# EAGLE board untitled (EAGLE 9.6.2), part 1 of 2
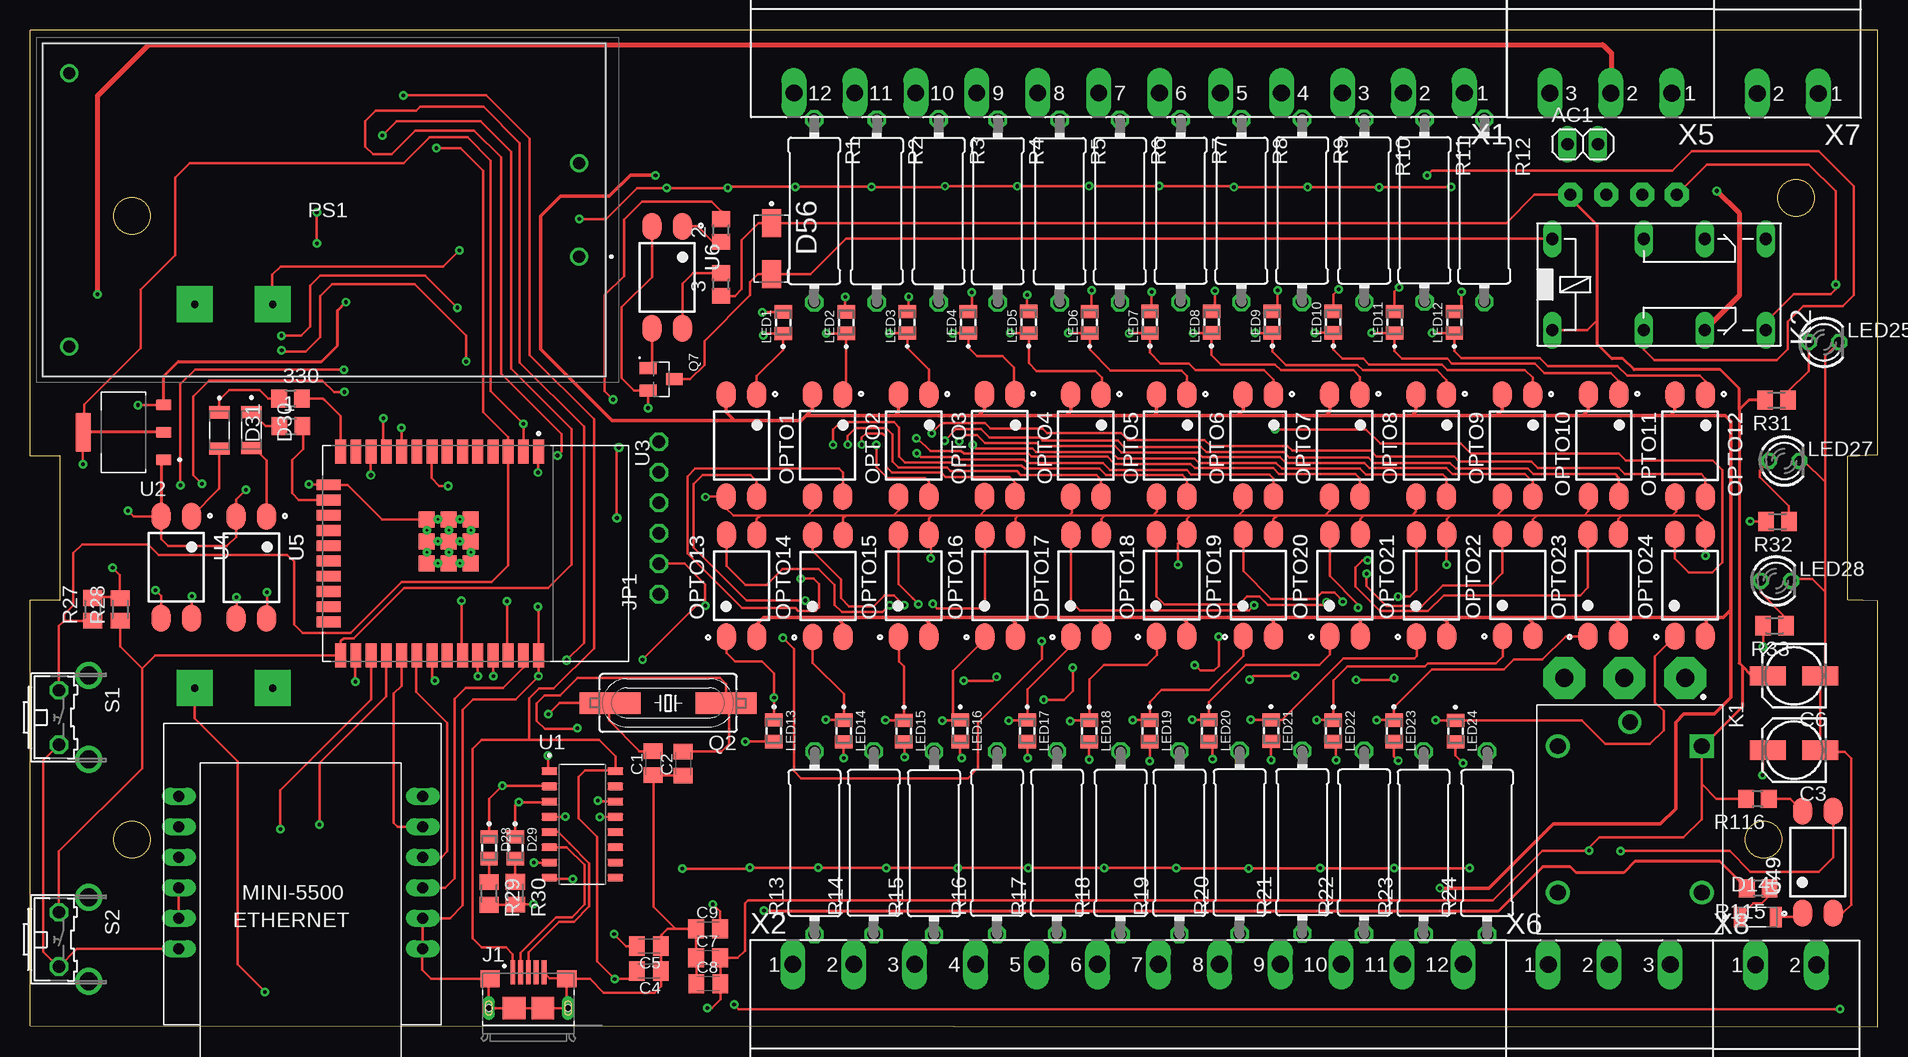
[diagram p2: board, top side]
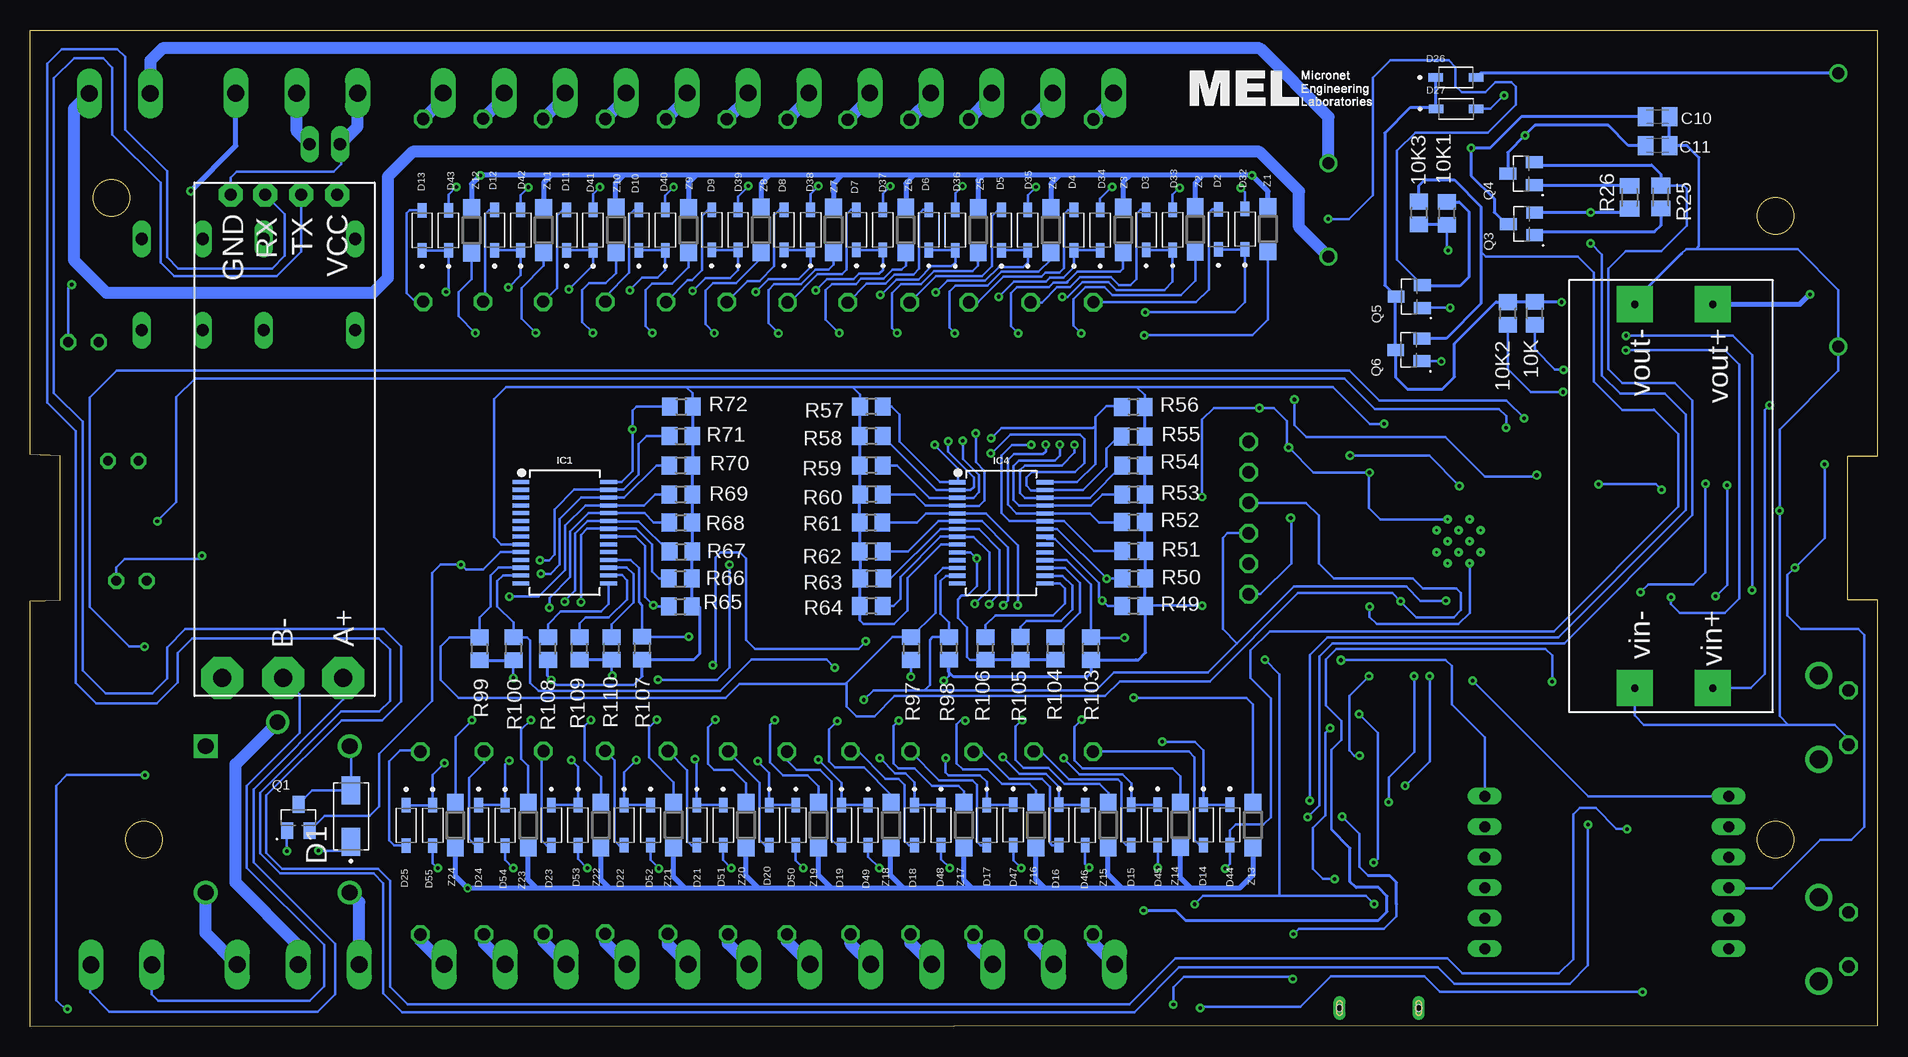
[diagram p3: board, bottom side, seen from below]

Size 154 x 83.1 mm. Coordinates in mm from the lower left corner, seen from the top.
Outline: 0,0.1 154,0 154,35.5 151.5,35.6 151.5,47.6 154,47.7 154,83.1 0,83.1 0,47.6 2.5,47.6 2.5,35.6 0,35.6 0,0.1
Outline: circle at 8.5,67.6 radius 1.5
Outline: circle at 8.5,15.6 radius 1.5
Outline: circle at 144.5,15.6 radius 1.5
Outline: circle at 147.2,69.1 radius 1.5
Copper layers (1*16): Top 0.035mm / dielectric 1.5mm / Bottom 0.035mm
Design rules "default *": minimum track width 6mil, minimum drill 0.3mm, track to track 6mil, track to pad 6mil, pad to pad 6mil, via to via 6mil, smd to smd 6mil, copper to edge 40mil, drill to drill 6mil, minimum pad ring 10mil, minimum via ring 8mil, stop-mask expansion 4mil, vias tented up to drill 0mil, thermal gap 10mil
Net classes: 0 default: drill 0.3 mm, clearance 0.2 mm

## Footprints (pad centres in the part's own frame; a part is rotated, then mirrored left to right if it is on the bottom)
R0805 = smd 1.3 x 1.5: 1 -0.95,0; 2 0.95,0
1X02 = drill 1.016 long: 1 -1.27,0; 2 1.27,0
C0805K = smd 1.3 x 1.6: 1 -1,0; 2 1,0
153CLV-0505 = smd 3 x 1.6: + 2.2,0; - -2.2,0
DIOM5226X240N = smd 2.33 x 1.55: A 2.135,0; C -2.135,0
SOD3715X145N = smd 1.21 x 0.73: A 1.68,0; C -1.68,0
LEDC2012X120N = smd 1.1 x 1.45: A 0.9,0; C -0.9,0
LEDC3216X120N = smd 1.01 x 1.73: + -1.51,0; - 1.51,0
SSOP28DB = smd 0.348 x 1.397: 1 -4.225,-3.656; 2 -3.575,-3.656; 3 -2.925,-3.656; 4 -2.275,-3.656; 5 -1.625,-3.656; 6 -0.975,-3.656; 7 -0.325,-3.656; 8 0.325,-3.656; 9 0.975,-3.656; 10 1.625,-3.656; 11 2.275,-3.656; 12 2.925,-3.656; 13 3.575,-3.656; 14 4.225,-3.656; 15 4.225,3.656; 16 3.575,3.656; 17 2.925,3.656; 18 2.275,3.656; 19 1.625,3.656; 20 0.975,3.656; 21 0.325,3.656; 22 -0.325,3.656; 23 -0.975,3.656; 24 -1.625,3.656; 25 -2.275,3.656; 26 -2.925,3.656; 27 -3.575,3.656; 28 -4.225,3.656
FCI_10118193-0001LF = smd 0.4 x 2: 1 -1.3,2.975; 2 -0.65,2.975; 3 0,2.975; 4 0.65,2.975; 5 1.3,2.975 | smd 1.6 x 1.4: S1 -3.2,2.45; S2 3.2,2.45 | smd 1.9 x 1.9: S3 1.2,0; S4 -1.2,0 | drill 0.5 pad 0.9 long: S5 -3.3,0; S6 3.3,0 | hole 0.5: -3.3,0; 3.3,0
1X06-CLEAN = drill 1.016 octagon: 1 -6.35,0; 2 -3.81,0; 3 -1.27,0; 4 1.27,0; 5 3.81,0; 6 6.35,0
RELAY_SRD-05VDC-SL-C = drill 1.32 square: A1 -6.1,6 | drill 1.32: A2 -6.1,-6; NC 6.1,6; NO 6.1,-6 | drill 1.29: COM -8.1,0
351 = drill 1.016 long: 1 -3.81,-3.81; 16 -3.81,3.81; O1 8.89,-3.81; O2 8.89,3.81; P1 3.81,-3.81; P2 3.81,3.81; S1 13.97,-3.81; S2 13.97,3.81
LED3MM = drill 0.813 octagon: A -1.27,0; K 1.27,0
MT3608 = drill 0.6 pad 3 square: VIN+ 22,-3; VIN- 22,-9.5; VOUT+ -10,-3; VOUT- -10,-9.5
SOT254P975X400-4N = smd 2.25 x 1.6: 1 -4.25,1.27; 2 -4.25,-1.27; 3 4.25,-1.27; 4 4.25,1.27
HLK10M05 = drill 1 pad 1.5: 1 0,0; 2 0,-7.8; 3 42.5,7.5; 4 42.5,-15.3
SOT95P240X120-3N = smd 1 x 1.4: 1 -0.95,-1.1; 2 0.95,-1.1; 3 0,1.1
SM49 = smd 5.08 x 1.778: 1 -4.826,0; 2 4.826,0
0414/15 = drill 1.016 octagon: 1 -7.62,0; 2 7.62,0
M0805 = smd 1.3 x 1.6: 1 -0.95,0; 2 0.95,0
B3F-31XX = drill 1.016 octagon: 1 -2.261,-1.245; 2 2.261,-1.245 | drill 1.499 pad 2.159: 3 -3.505,1.245; 4 3.505,1.245
TTL-RS485 = drill 1.5 pad 3.5 octagon: A -19.7,-6; B -19.7,-1; P$7 -19.7,4.1 | drill 1 pad 2 octagon: GND 20.6,3.37; RX 20.581,0.505; TX 20.583,-2.493; VCC 20.6,-5.47
SOIC127P600X180-16N = smd 1.31 x 0.62: 1 -2.75,4.445; 2 -2.75,3.175; 3 -2.75,1.905; 4 -2.75,0.635; 5 -2.75,-0.635; 6 -2.75,-1.905; 7 -2.75,-3.175; 8 -2.75,-4.445; 9 2.75,-4.445; 10 2.75,-3.175; 11 2.75,-1.905; 12 2.75,-0.635; 13 2.75,0.635; 14 2.75,1.905; 15 2.75,3.175; 16 2.75,4.445
SOT229P700X180-4N = smd 1.31 x 0.93: 1 -3.345,2.29; 2 -3.345,0; 3 -3.345,-2.29 | smd 1.31 x 3.24: 4 3.345,0
MODULE_ESP32-WROOM-32D = smd 2 x 0.9: 1 -8.5,5.26; 2 -8.5,3.99; 3 -8.5,2.72; 4 -8.5,1.45; 5 -8.5,0.18; 6 -8.5,-1.09; 7 -8.5,-2.36; 8 -8.5,-3.63; 9 -8.5,-4.9; 10 -8.5,-6.17; 11 -8.5,-7.44; 12 -8.5,-8.71; 13 -8.5,-9.98; 14 -8.5,-11.25; 25 8.5,-11.25; 26 8.5,-9.98; 27 8.5,-8.71; 28 8.5,-7.44; 29 8.5,-6.17; 30 8.5,-4.9; 31 8.5,-3.63; 32 8.5,-2.36; 33 8.5,-1.09; 34 8.5,0.18; 35 8.5,1.45; 36 8.5,2.72; 37 8.5,3.99; 38 8.5,5.26 | smd 0.9 x 2: 15 -5.715,-12.25; 16 -4.445,-12.25; 17 -3.175,-12.25; 18 -1.905,-12.25; 19 -0.635,-12.25; 20 0.635,-12.25; 21 1.905,-12.25; 22 3.175,-12.25; 23 4.445,-12.25; 24 5.715,-12.25 | smd 1.33 x 1.33: 39_1 -2.835,-0.405; 39_2 -1,-0.405; 39_3 0.835,-0.405; 39_4 -2.835,-2.24; 39_5 -1,-2.24; 39_6 0.835,-2.24; 39_7 -2.835,-4.075; 39_8 -1,-4.075; 39_9 0.835,-4.075 | drill 0.2 pad 0.3: 39_10 -1.917,-0.405; 39_11 -0.083,-0.405; 39_12 -2.835,-1.323; 39_13 -1,-1.323; 39_14 0.835,-1.323; 39_15 -1.917,-2.24; 39_16 -0.083,-2.24; 39_17 -2.835,-3.158; 39_18 -1,-3.158; 39_19 0.835,-3.158; 39_20 -1.917,-4.075; 39_21 -0.083,-4.075
MINI_W5500 = drill 0.914 long: 3V3 21.844,-8.89; 3V3.2 21.844,-11.43; CS 1.524,-16.51; GND 1.524,-6.35; GND.2 1.524,-8.89; GND.3 21.844,-6.35; INT 1.524,-19.05; MISO 21.844,-19.05; MOSI 1.524,-11.43; NC 21.844,-13.97; RST 21.844,-16.51; SCLK 1.524,-13.97
MSTBA12 = drill 1.397 long: 1 -27.94,5.08; 2 -22.86,5.08; 3 -17.78,5.08; 4 -12.7,5.08; 5 -7.62,5.08; 6 -2.54,5.08; 7 2.54,5.08; 8 7.62,5.08; 9 12.7,5.08; 10 17.78,5.08; 11 22.86,5.08; 12 27.94,5.08
MSTBA3 = drill 1.397 long: 1 -5.08,5.08; 2 0,5.08; 3 5.08,5.08
MSTBA2 = drill 1.397 long: 1 -2.54,5.08; 2 2.54,5.08
SOD123 = smd 1.4 x 1.4: A 1.9,0; C -1.9,0

## Placement (x,y rotation side)
1  330  [R0805]  21.75,50.06 0 top
2  330  [R0805]  57.61,66.38 90 top
3  10k  [R0805]  57.61,61.88 90 top
10K  [R0805]  28.58,59.47 90 bottom
10K1  [R0805]  35.91,67.81 90 bottom
10K2  [R0805]  30.81,59.46 90 bottom
10K3  [R0805]  38.21,67.84 90 bottom
330  [R0805]  21.72,52.38 0 top
AC1  [1X02]  129.43,73.58 0 top
C1  22pF  [C0805K]  51.95,21.97 90 top
C2  22pF  [C0805K]  54.44,21.94 90 top
C3  10uF/16V  [153CLV-0505]  147.04,23.06 180 top
C4  1uF  [C0805K]  51.59,4.64 180 top
C5  100nF  [C0805K]  51.59,6.72 180 top
C6  10uF/16V  [153CLV-0505]  147.04,29.25 180 top
C7  1uF  [C0805K]  56.52,5.75 0 top
C8  1uF  [C0805K]  56.54,3.59 0 top
C9  1uF  [C0805K]  56.52,8.15 0 top
C10  100nF  [C0805K]  18.33,75.87 180 bottom
C11  100nF  [C0805K]  18.34,73.46 180 bottom
D1  US1M-13  [DIOM5226X240N]  127.25,17.55 90 bottom
D2  1N5819HW-7  [SOD3715X145N]  54.94,66.48 90 bottom
D3  1N5819HW-7  [SOD3715X145N]  60.95,66.43 90 bottom
D4  1N5819HW-7  [SOD3715X145N]  66.99,66.41 90 bottom
D5  1N5819HW-7  [SOD3715X145N]  73.03,66.42 90 bottom
D6  1N5819HW-7  [SOD3715X145N]  79.08,66.43 90 bottom
D7  1N5819HW-7  [SOD3715X145N]  85.12,66.43 90 bottom
D8  1N5819HW-7  [SOD3715X145N]  91.15,66.44 90 bottom
D9  1N5819HW-7  [SOD3715X145N]  97.18,66.43 90 bottom
D10  1N5819HW-7  [SOD3715X145N]  103.25,66.42 90 bottom
D11  1N5819HW-7  [SOD3715X145N]  109.26,66.42 90 bottom
D12  1N5819HW-7  [SOD3715X145N]  115.27,66.41 90 bottom
D13  1N5819HW-7  [SOD3715X145N]  121.31,66.39 90 bottom
D14  1N5819HW-7  [SOD3715X145N]  56.19,16.83 270 bottom
D15  1N5819HW-7  [SOD3715X145N]  62.21,16.83 270 bottom
D16  1N5819HW-7  [SOD3715X145N]  68.23,16.82 270 bottom
D17  1N5819HW-7  [SOD3715X145N]  74.24,16.81 270 bottom
D18  1N5819HW-7  [SOD3715X145N]  80.27,16.8 270 bottom
D19  1N5819HW-7  [SOD3715X145N]  86.35,16.81 270 bottom
D20  1N5819HW-7  [SOD3715X145N]  92.38,16.81 270 bottom
D21  1N5819HW-7  [SOD3715X145N]  98.42,16.81 270 bottom
D22  1N5819HW-7  [SOD3715X145N]  104.48,16.8 270 bottom
D23  1N5819HW-7  [SOD3715X145N]  110.53,16.8 270 bottom
D24  1N5819HW-7  [SOD3715X145N]  116.61,16.8 270 bottom
D25  1N5819HW-7  [SOD3715X145N]  122.64,16.79 270 bottom
D26  1N5819HW-7  [SOD3715X145N]  35.14,79.14 0 bottom
D27  1N5819HW-7  [SOD3715X145N]  35.13,76.52 0 bottom
D28  SML-LXT0805IW-TR  [LEDC2012X120N]  38.27,14.92 270 top
D29  SML-LXT0805IW-TR  [LEDC2012X120N]  40.45,14.92 270 top
D30  LHN974_RED_LED_1206  [LEDC3216X120N]  18.45,49.74 270 top
D31  LHN974_RED_LED_1206  [LEDC3216X120N]  15.79,49.72 270 top
D32  1N5819HW-7  [SOD3715X145N]  52.72,66.49 90 bottom
D33  1N5819HW-7  [SOD3715X145N]  58.76,66.43 90 bottom
D34  1N5819HW-7  [SOD3715X145N]  64.79,66.42 90 bottom
D35  1N5819HW-7  [SOD3715X145N]  70.83,66.41 90 bottom
D36  1N5819HW-7  [SOD3715X145N]  76.87,66.42 90 bottom
D37  1N5819HW-7  [SOD3715X145N]  82.91,66.43 90 bottom
D38  1N5819HW-7  [SOD3715X145N]  88.93,66.44 90 bottom
D39  1N5819HW-7  [SOD3715X145N]  94.98,66.43 90 bottom
D40  1N5819HW-7  [SOD3715X145N]  101.05,66.41 90 bottom
D41  1N5819HW-7  [SOD3715X145N]  107.07,66.41 90 bottom
D42  1N5819HW-7  [SOD3715X145N]  113.09,66.41 90 bottom
D43  1N5819HW-7  [SOD3715X145N]  119.11,66.39 90 bottom
D44  1N5819HW-7  [SOD3715X145N]  53.98,16.83 270 bottom
D45  1N5819HW-7  [SOD3715X145N]  60,16.83 270 bottom
D46  1N5819HW-7  [SOD3715X145N]  66.05,16.81 270 bottom
D47  1N5819HW-7  [SOD3715X145N]  72.04,16.82 270 bottom
D48  1N5819HW-7  [SOD3715X145N]  78.07,16.81 270 bottom
D49  1N5819HW-7  [SOD3715X145N]  84.15,16.81 270 bottom
D50  1N5819HW-7  [SOD3715X145N]  90.17,16.81 270 bottom
D51  1N5819HW-7  [SOD3715X145N]  96.22,16.81 270 bottom
D52  1N5819HW-7  [SOD3715X145N]  102.27,16.81 270 bottom
D53  1N5819HW-7  [SOD3715X145N]  108.32,16.8 270 bottom
D54  1N5819HW-7  [SOD3715X145N]  114.39,16.8 270 bottom
D55  1N5819HW-7  [SOD3715X145N]  120.43,16.79 270 bottom
D56  US1M-13  [DIOM5226X240N]  61.81,64.88 270 top
D146  LHN974_RED_LED_1206  [LEDC3216X120N]  144.02,9.15 0 top
IC1  MCP23017SS  [SSOP28DB]  109.43,41.19 270 bottom
IC4  MCP23017SS  [SSOP28DB]  73.04,41.17 270 bottom
J1  10118193-0001LF  [FCI_10118193-0001LF]  41.55,1.56 0 top
JP1  [1X06-CLEAN]  52.41,42.41 90 top
K1  SRD-05VDC-SL-C  [RELAY_SRD-05VDC-SL-C]  133.36,17.29 270 top
K2  351  [351]  130.71,61.88 0 top
LED1  SML-LXT0805IW-TR  [LEDC2012X120N]  62.78,58.7 90 top
LED2  SML-LXT0805IW-TR  [LEDC2012X120N]  68.04,58.71 90 top
LED3  SML-LXT0805IW-TR  [LEDC2012X120N]  73.13,58.72 90 top
LED4  SML-LXT0805IW-TR  [LEDC2012X120N]  78.22,58.73 90 top
LED5  SML-LXT0805IW-TR  [LEDC2012X120N]  83.26,58.73 90 top
LED6  SML-LXT0805IW-TR  [LEDC2012X120N]  88.33,58.73 90 top
LED7  SML-LXT0805IW-TR  [LEDC2012X120N]  93.36,58.73 90 top
LED8  SML-LXT0805IW-TR  [LEDC2012X120N]  98.48,58.75 90 top
LED9  SML-LXT0805IW-TR  [LEDC2012X120N]  103.56,58.74 90 top
LED10  SML-LXT0805IW-TR  [LEDC2012X120N]  108.64,58.74 90 top
LED11  SML-LXT0805IW-TR  [LEDC2012X120N]  113.74,58.73 90 top
LED12  SML-LXT0805IW-TR  [LEDC2012X120N]  118.73,58.72 90 top
LED13  SML-LXT0805IW-TR  [LEDC2012X120N]  62.02,24.67 270 top
LED14  SML-LXT0805IW-TR  [LEDC2012X120N]  67.84,24.65 270 top
LED15  SML-LXT0805IW-TR  [LEDC2012X120N]  72.84,24.65 270 top
LED16  SML-LXT0805IW-TR  [LEDC2012X120N]  77.54,24.67 270 top
LED17  SML-LXT0805IW-TR  [LEDC2012X120N]  83.13,24.67 270 top
LED18  SML-LXT0805IW-TR  [LEDC2012X120N]  88.29,24.65 270 top
LED19  SML-LXT0805IW-TR  [LEDC2012X120N]  93.34,24.67 270 top
LED20  SML-LXT0805IW-TR  [LEDC2012X120N]  98.27,24.67 270 top
LED21  SML-LXT0805IW-TR  [LEDC2012X120N]  103.44,24.68 270 top
LED22  SML-LXT0805IW-TR  [LEDC2012X120N]  108.64,24.66 270 top
LED23  SML-LXT0805IW-TR  [LEDC2012X120N]  113.7,24.66 270 top
LED24  SML-LXT0805IW-TR  [LEDC2012X120N]  118.82,24.64 270 top
LED25  TLLY4400  [LED3MM]  149.53,57.08 0 top
LED27  TLLY4400  [LED3MM]  146.23,47.18 0 top
LED28  TLLY4400  [LED3MM]  145.53,37.18 0 top
MT1  [MT3608]  10.73,50.23 270 bottom
OPTO1  PC817X2NIP0F  [SOT254P975X400-4N]  59.31,48.45 270 top
OPTO2  PC817X2NIP0F  [SOT254P975X400-4N]  66.48,48.46 270 top
OPTO3  PC817X2NIP0F  [SOT254P975X400-4N]  73.67,48.45 270 top
OPTO4  PC817X2NIP0F  [SOT254P975X400-4N]  80.83,48.46 270 top
OPTO5  PC817X2NIP0F  [SOT254P975X400-4N]  88.01,48.46 270 top
OPTO6  PC817X2NIP0F  [SOT254P975X400-4N]  95.17,48.45 270 top
OPTO7  PC817X2NIP0F  [SOT254P975X400-4N]  102.38,48.45 270 top
OPTO8  PC817X2NIP0F  [SOT254P975X400-4N]  109.59,48.46 270 top
OPTO9  PC817X2NIP0F  [SOT254P975X400-4N]  116.8,48.46 270 top
OPTO10  PC817X2NIP0F  [SOT254P975X400-4N]  123.99,48.46 270 top
OPTO11  PC817X2NIP0F  [SOT254P975X400-4N]  131.18,48.46 270 top
OPTO12  PC817X2NIP0F  [SOT254P975X400-4N]  138.38,48.44 270 top
OPTO13  PC817X2NIP0F  [SOT254P975X400-4N]  59.31,36.76 90 top
OPTO14  PC817X2NIP0F  [SOT254P975X400-4N]  66.51,36.74 90 top
OPTO15  PC817X2NIP0F  [SOT254P975X400-4N]  73.66,36.77 90 top
OPTO16  PC817X2NIP0F  [SOT254P975X400-4N]  80.86,36.77 90 top
OPTO17  PC817X2NIP0F  [SOT254P975X400-4N]  88.03,36.78 90 top
OPTO18  PC817X2NIP0F  [SOT254P975X400-4N]  95.16,36.8 90 top
OPTO19  PC817X2NIP0F  [SOT254P975X400-4N]  102.4,36.8 90 top
OPTO20  PC817X2NIP0F  [SOT254P975X400-4N]  109.61,36.8 90 top
OPTO21  PC817X2NIP0F  [SOT254P975X400-4N]  116.82,36.79 90 top
OPTO22  PC817X2NIP0F  [SOT254P975X400-4N]  124.02,36.83 90 top
OPTO23  PC817X2NIP0F  [SOT254P975X400-4N]  131.14,36.8 90 top
OPTO24  PC817X2NIP0F  [SOT254P975X400-4N]  138.37,36.8 90 top
PS1  HLK-10M05  [HLK10M05]  45.76,64.2 180 top
Q1  S9013  [SOT95P240X120-3N]  131.62,17.44 0 bottom
Q2  12MHz  [SM49]  53.2,26.98 180 top
Q3  MMBT3904  [SOT95P240X120-3N]  29.68,66.93 90 bottom
Q4  MMBT3904  [SOT95P240X120-3N]  29.71,71.13 90 bottom
Q5  S9013  [SOT95P240X120-3N]  39.03,60.88 90 bottom
Q6  S9013  [SOT95P240X120-3N]  39.07,56.43 90 bottom
Q7  S9013  [SOT95P240X120-3N]  52.61,53.98 270 top
R1  [0414/15]  65.37,68.02 270 top
R2  [0414/15]  70.59,68.01 270 top
R3  [0414/15]  75.74,68.02 270 top
R4  [0414/15]  80.67,68 270 top
R5  [0414/15]  85.83,68 270 top
R6  [0414/15]  90.85,68 270 top
R7  [0414/15]  95.92,68.04 270 top
R8  [0414/15]  100.98,68.04 270 top
R9  [0414/15]  106.04,68.06 270 top
R10  [0414/15]  111.22,68.06 270 top
R11  [0414/15]  116.24,68.07 270 top
R12  [0414/15]  121.22,68.06 270 top
R13  [0414/15]  65.4,15.32 90 top
R14  [0414/15]  70.33,15.33 90 top
R15  [0414/15]  75.36,15.3 90 top
R16  [0414/15]  80.61,15.33 90 top
R17  [0414/15]  85.6,15.33 90 top
R18  [0414/15]  90.91,15.32 90 top
R19  [0414/15]  95.81,15.33 90 top
R20  [0414/15]  100.83,15.36 90 top
R21  [0414/15]  106.06,15.38 90 top
R22  [0414/15]  111.2,15.35 90 top
R23  [0414/15]  116.17,15.32 90 top
R24  [0414/15]  121.46,15.31 90 top
R25  10k  [M0805]  18.07,69.17 270 bottom
R26  10k  [M0805]  20.66,69.16 90 bottom
R27  10k  [M0805]  5.22,34.79 90 top
R28  10k  [M0805]  7.52,34.79 90 top
R29  330  [M0805]  38.27,11.11 270 top
R30  330  [M0805]  40.46,11.13 270 top
R31  330  [M0805]  145.59,52.24 180 top
R32  330  [M0805]  145.67,42.13 180 top
R33  330  [M0805]  145.42,33.43 180 top
R49  [R0805]  61.99,35.09 0 bottom
R50  [R0805]  61.99,37.36 0 bottom
R51  [R0805]  62.01,39.65 0 bottom
R52  [R0805]  62.03,42.07 0 bottom
R53  [R0805]  62.01,44.38 0 bottom
R54  [R0805]  62.02,46.79 0 bottom
R55  [R0805]  62.04,49.19 0 bottom
R56  [R0805]  62.03,51.68 0 bottom
R57  [R0805]  83.86,51.71 180 bottom
R58  [R0805]  83.87,49.23 180 bottom
R59  [R0805]  83.87,46.8 180 bottom
R60  [R0805]  83.86,44.38 180 bottom
R61  [R0805]  83.9,42.02 180 bottom
R62  [R0805]  83.87,39.63 180 bottom
R63  [R0805]  83.84,37.35 180 bottom
R64  [R0805]  83.88,35.08 180 bottom
R65  [R0805]  99.79,35.05 0 bottom
R66  [R0805]  99.79,37.36 0 bottom
R67  [R0805]  99.74,39.6 0 bottom
R68  [R0805]  99.76,42.04 0 bottom
R69  [R0805]  99.75,44.38 0 bottom
R70  [R0805]  99.75,46.81 0 bottom
R71  [R0805]  99.74,49.23 0 bottom
R72  [R0805]  99.71,51.69 0 bottom
R97  [R0805]  80.55,31.53 270 bottom
R98  [R0805]  77.41,31.53 270 bottom
R99  [R0805]  116.53,31.5 270 bottom
R100  [R0805]  113.7,31.52 270 bottom
R103  [R0805]  65.58,31.53 90 bottom
R104  [R0805]  68.51,31.53 90 bottom
R105  [R0805]  71.45,31.54 90 bottom
R106  [R0805]  74.35,31.53 90 bottom
R107  [R0805]  102.97,31.56 270 bottom
R108  [R0805]  110.83,31.53 90 bottom
R109  [R0805]  108.18,31.53 90 bottom
R110  [R0805]  105.51,31.54 90 bottom
R115  [R0805]  144.06,11.53 180 top
R116  [R0805]  143.99,19 180 top
S1  [B3F-31XX]  3.67,25.78 270 top
S2  [B3F-31XX]  3.66,7.28 270 top
TTL-RS1  [TTL-RS485]  133.88,48.78 90 bottom
U1  CH340G  [SOIC127P600X180-16N]  46.04,16.86 0 top
U2  AMS1117  [SOT229P700X180-4N]  7.78,49.56 180 top
U3  ESP32-WROOM-32D  [MODULE_ESP32-WROOM-32D]  37.14,39.47 270 top
U4  PC817X2NIP0F  [SOT254P975X400-4N]  12.19,38.3 270 top
U5  PC817X2NIP0F  [SOT254P975X400-4N]  18.46,38.28 270 top
U6  PC817X2NIP0F  [SOT254P975X400-4N]  53.11,62.48 270 top
U49  PC817X2NIP0F  [SOT254P975X400-4N]  149.03,13.73 90 top
U$1  MINI_W5500  [MINI_W5500]  34.26,0.16 180 top
X1  MSTBA12  [MSTBA12]  91.62,82.93 180 top
X2  MSTBA12  [MSTBA12]  91.53,0.11 0 top
X5  MSTBA3  [MSTBA3]  131.77,82.92 180 top
X6  MSTBA3  [MSTBA3]  131.64,0.1 0 top
X7  MSTBA2  [MSTBA2]  146.51,82.89 180 top
X8  MSTBA2  [MSTBA2]  146.38,0.08 0 top
Z1  [SOD123]  50.81,66.5 90 bottom
Z2  [SOD123]  56.87,66.46 90 bottom
Z3  [SOD123]  62.88,66.43 90 bottom
Z4  [SOD123]  68.91,66.41 90 bottom
Z5  [SOD123]  74.96,66.42 90 bottom
Z6  [SOD123]  80.99,66.42 90 bottom
Z7  [SOD123]  87.03,66.43 90 bottom
Z8  [SOD123]  93.06,66.44 90 bottom
Z9  [SOD123]  99.11,66.41 90 bottom
Z10  [SOD123]  105.15,66.42 90 bottom
Z11  [SOD123]  111.18,66.41 90 bottom
Z12  [SOD123]  117.19,66.4 90 bottom
Z13  [SOD123]  52.05,16.82 270 bottom
Z14  [SOD123]  58.09,16.83 270 bottom
Z15  [SOD123]  64.12,16.82 270 bottom
Z16  [SOD123]  70.15,16.81 270 bottom
Z17  [SOD123]  76.14,16.81 270 bottom
Z18  [SOD123]  82.23,16.8 270 bottom
Z19  [SOD123]  88.26,16.81 270 bottom
Z20  [SOD123]  94.3,16.81 270 bottom
Z21  [SOD123]  100.35,16.82 270 bottom
Z22  [SOD123]  106.42,16.8 270 bottom
Z23  [SOD123]  112.47,16.8 270 bottom
Z24  [SOD123]  118.53,16.8 270 bottom